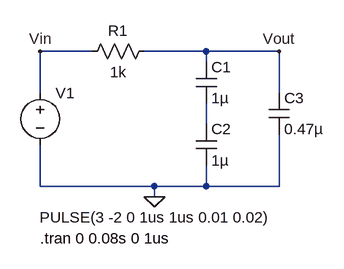
[diagram p0: schematic ckt1.asc]
ckt1.asc, the LTspice schematic file:
Version 4
SHEET 1 880 680
WIRE 128 64 48 64
WIRE 304 64 208 64
WIRE 416 64 304 64
WIRE 304 80 304 64
WIRE 48 128 48 64
WIRE 416 128 416 64
WIRE 304 176 304 144
WIRE 48 272 48 208
WIRE 224 272 48 272
WIRE 304 272 304 240
WIRE 304 272 224 272
WIRE 416 272 416 192
WIRE 416 272 304 272
WIRE 224 288 224 272
FLAG 224 288 0
FLAG 48 64 Vin
FLAG 416 64 Vout
SYMBOL voltage 48 112 R0
WINDOW 3 -1 208 Left 2
WINDOW 123 0 0 Left 0
WINDOW 39 0 0 Left 0
SYMATTR InstName V1
SYMATTR Value PULSE(3 -2 0 1us 1us 0.01 0.02)
SYMBOL cap 288 80 R0
SYMATTR InstName C1
SYMATTR Value 1µ
SYMBOL cap 288 176 R0
SYMATTR InstName C2
SYMATTR Value 1µ
SYMBOL cap 400 128 R0
SYMATTR InstName C3
SYMATTR Value 0.47µ
SYMBOL res 112 80 R270
WINDOW 0 32 56 VTop 2
WINDOW 3 0 56 VBottom 2
SYMATTR InstName R1
SYMATTR Value 1k
TEXT 48 352 Left 2 !.tran 0 0.08s 0 1us

The netlist it stands for:
* ckt1.asc
V1 Vin 0 PULSE(3 -2 0 1us 1us 0.01 0.02)
C1 Vout N001 1µ
C2 N001 0 1µ
C3 Vout 0 0.47µ
R1 Vin Vout 1k
.tran 0 0.08s 0 1us
.backanno
.end

* Results of the author's LTspice run, read from the files saved beside the schematic
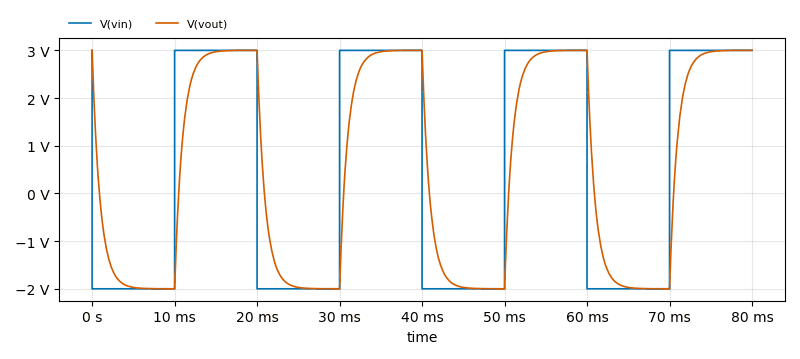
[diagram p1: Transient Analysis of ckt1.asc, plotted from the saved traces]
* Transient Analysis, 1 run:
*   V(vin): min -2 V, max 3 V, average 499.8 mV, rms 2.549 V, last 3 V
*   V(vout): min -2 V, max 3 V, average 499.6 mV, rms 2.3 V, last 3 V